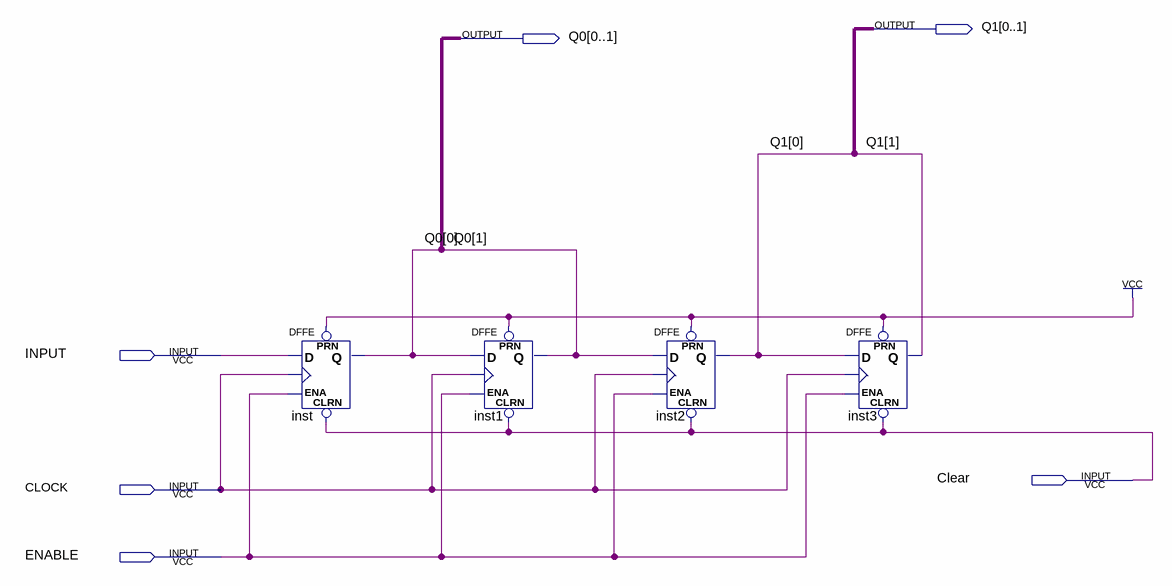
[diagram p0: schematic sheet]
// Quartus schematic register.bdf as structural Verilog: 4 symbols, 6 pins
module register (
  input  INPUT,
  input  Clear,
  input  CLOCK,
  input  ENABLE,
  output [0:1] Q1,
  output [0:1] Q0
);

  DFFE inst (.PRN(1'b1), .CLRN(Clear), .D(INPUT), .CLK(CLOCK), .ENA(ENABLE), .Q(Q0[0]));
  DFFE inst1 (.PRN(1'b1), .CLRN(Clear), .D(Q0[0]), .CLK(CLOCK), .ENA(ENABLE), .Q(Q0[1]));
  DFFE inst2 (.PRN(1'b1), .CLRN(Clear), .D(Q0[1]), .CLK(CLOCK), .ENA(ENABLE), .Q(Q1[0]));
  DFFE inst3 (.PRN(1'b1), .CLRN(Clear), .D(Q1[0]), .CLK(CLOCK), .ENA(ENABLE), .Q(Q1[1]));
endmodule
